# EAGLE design TMP Tester (EAGLE 6.5.0)
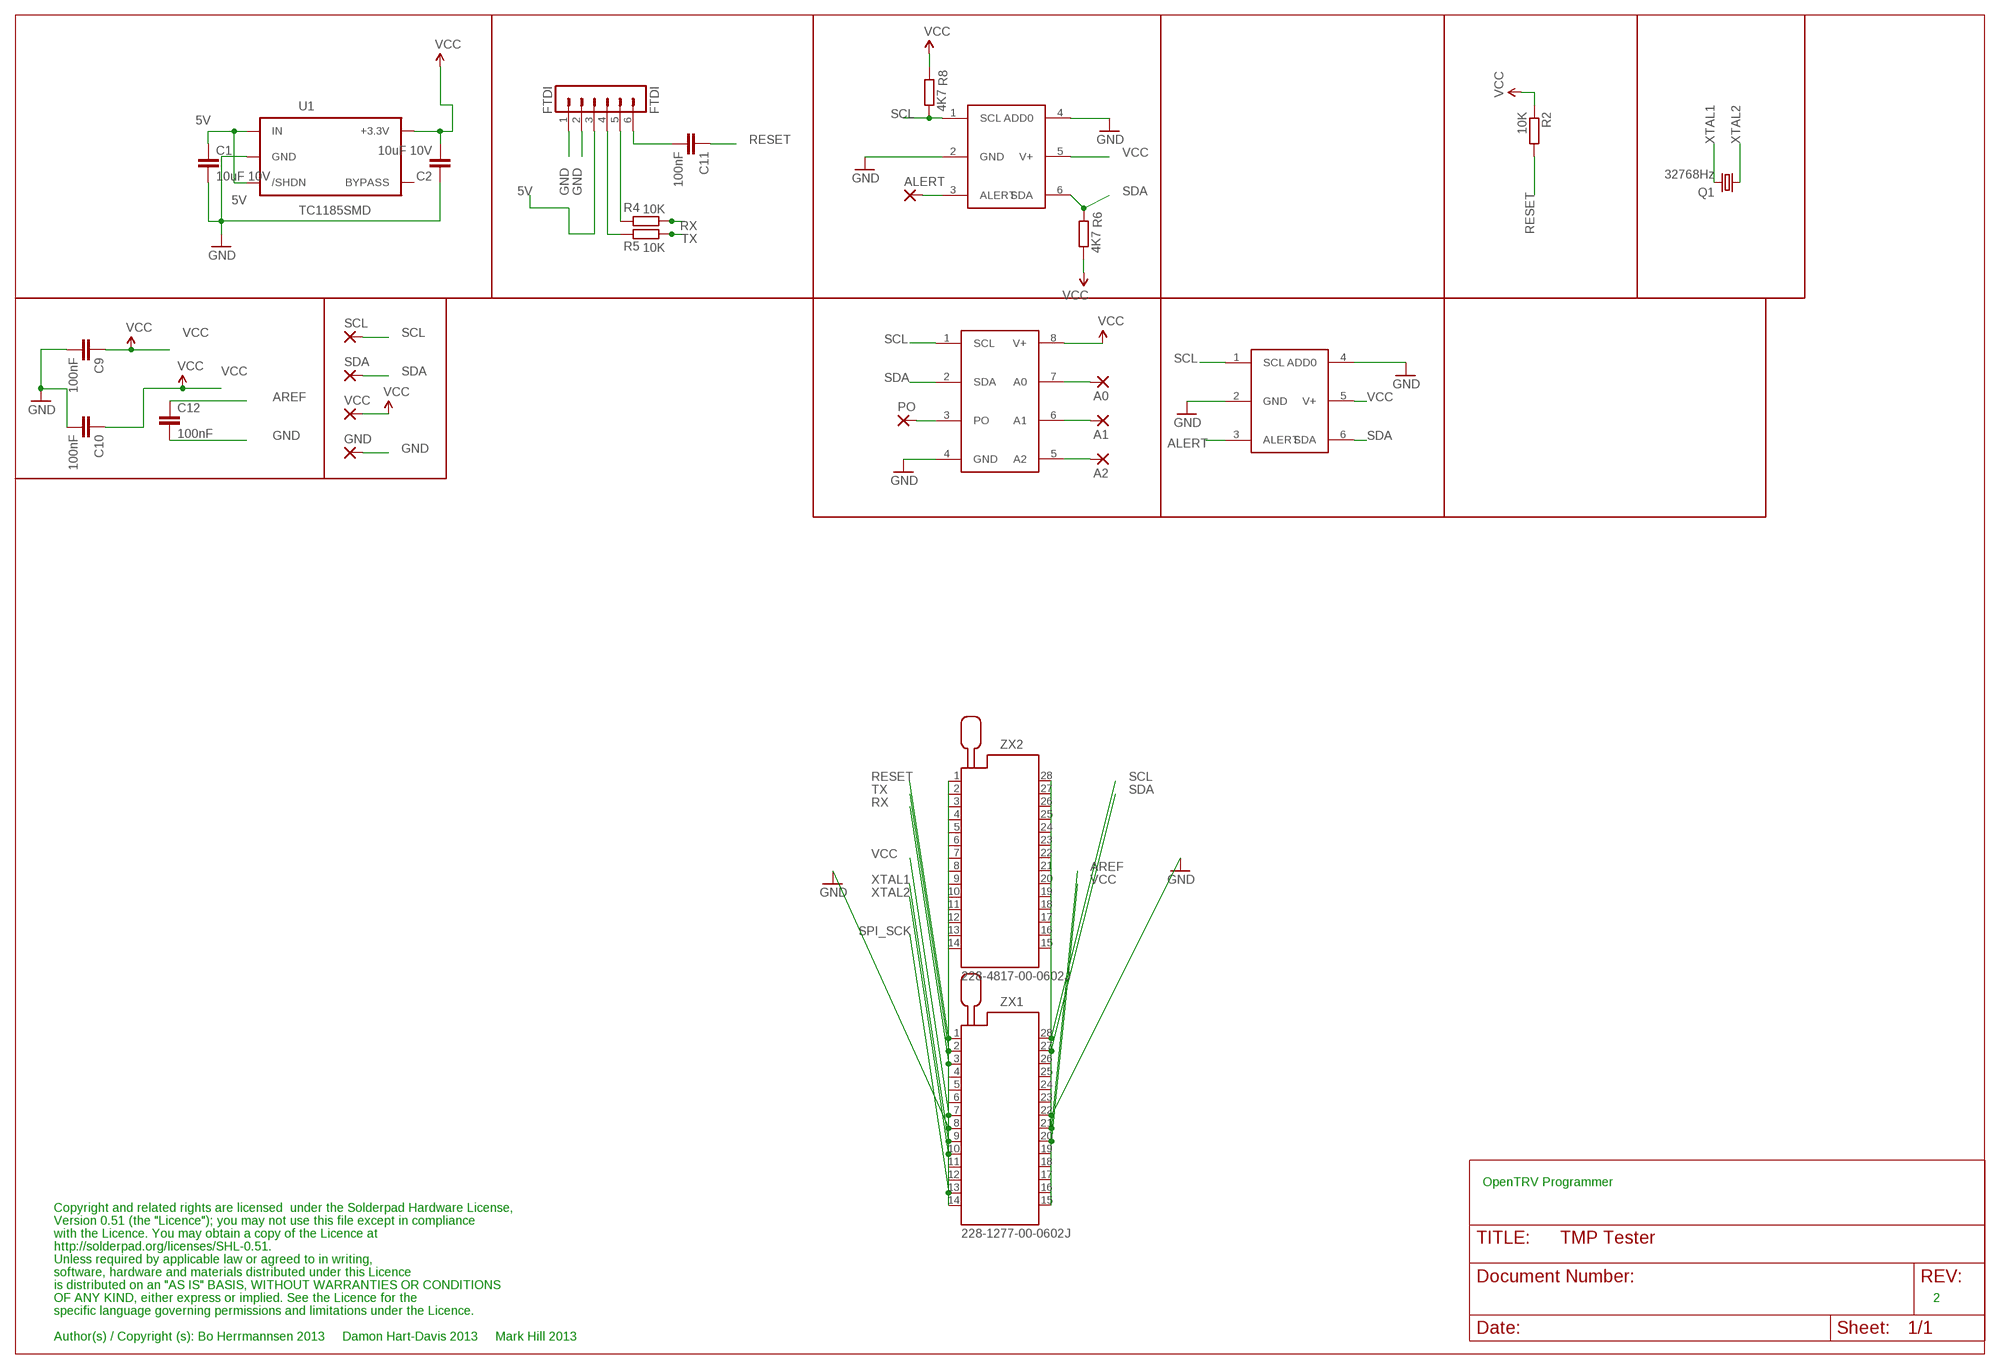
[diagram p0: schematic, sheet 1]

## Parts
A0  2,15/1,0  [2,15/1,0]
A1  2,15/1,0  [2,15/1,0]
A2  2,15/1,0  [2,15/1,0]
ALERT  2,15/1,0  [2,15/1,0]
C1  10uF 10V  CAP0603-CAP  [0603-CAP]
C2  10uF 10V  CAP0603-CAP  [0603-CAP]
C9  100nF  CAP0603-CAP  [0603-CAP]
C10  100nF  CAP0603-CAP  [0603-CAP]
C11  100nF  CAP0603-CAP  [0603-CAP]
C12  100nF  CAP0603-CAP  [0603-CAP]
FTDI  FTDI  MA06-1  [MA06-1]
GND  2,15/1,0  [2,15/1,0]
PO  2,15/1,0  [2,15/1,0]
Q1  32768Hz  MC-306  [MC-306]
R2  10K  R-EU_R0603  [R0603]
R4  10K  R-EU_R0603  [R0603]
R5  10K  R-EU_R0603  [R0603]
R6  4K7  R-EU_R0603  [R0603]
R8  4K7  R-EU_R0603  [R0603]
SCL  2,15/1,0  [2,15/1,0]
SDA  2,15/1,0  [2,15/1,0]
TMP112  TMP112  [TMP112]
U1  TC1185SMD  [TC1185]
U$2  TMP112  [TMP112]
U$3  DS620  [DS620]
VCC  2,15/1,0  [2,15/1,0]
ZX1  228-1277-00-0602J  [228-1277-00-0602J]
ZX2  228-4817-00-0602J  [228-4817-00-0602J]

## Nets
5V: C1.1 FTDI.3(VCC) U1.1(IN) U1.3(/SHDN)
ALERT: ALERT.1(P) TMP112.3(ALERT) U$2.3(ALERT)
AREF: C12.1 ZX1.21 ZX2.21
GND: C1.2 C2.1 C9.2 C10.2 C12.2 FTDI.1(GND) FTDI.2(CTS) GND.1(P) TMP112.2(GND) TMP112.4(ADD0) U1.2(GND) U$2.2(GND) U$2.4(ADD0) U$3.4(GND) ZX1.8 ZX1.22 ZX2.8 ZX2.22
N$1: C11.2 FTDI.6(RTS)
N$3: FTDI.4(TX) R5.2
N$5: FTDI.5(RX) R4.2
N$6: A0.1(P) U$3.7(A0)
N$7: ZX1.4 ZX2.4
N$8: ZX1.5 ZX2.5
N$11: ZX1.6 ZX2.6
N$13: A1.1(P) U$3.6(A1)
N$14: A2.1(P) U$3.5(A2)
N$15: PO.1(P) U$3.3(PO)
N$16: ZX1.11 ZX2.11
N$17: ZX1.12 ZX2.12
N$20: ZX1.14 ZX2.14
N$21: ZX1.15 ZX2.15
N$24: ZX1.16 ZX2.16
N$25: ZX1.17 ZX2.17
N$26: ZX1.18 ZX2.18
N$28: ZX1.19 ZX2.19
N$30: ZX1.23 ZX2.23
N$31: ZX1.24 ZX2.24
N$32: ZX1.25 ZX2.25
N$33: ZX1.26 ZX2.26
RESET: C11.1 R2.2 ZX1.1 ZX2.1
RX: R4.1 ZX1.3 ZX2.3
SCL: R8.1 SCL.1(P) TMP112.1(SCL) U$2.1(SCL) U$3.1(SCL) ZX1.28 ZX2.28
SDA: R6.2 SDA.1(P) TMP112.6(SDA) U$2.6(SDA) U$3.2(SDA) ZX1.27 ZX2.27
SPI_SCK: ZX1.13 ZX2.13
TX: R5.1 ZX1.2 ZX2.2
VCC: C2.2 C9.1 C10.1 R2.1 R6.1 R8.2 TMP112.5(V+) U1.5(+3.3V) U$2.5(V+) U$3.8(V+) VCC.1(P) ZX1.7 ZX1.20 ZX2.7 ZX2.20
XTAL1: Q1.4 ZX1.9 ZX2.9
XTAL2: Q1.1 ZX1.10 ZX2.10
Unconnected: U1.4(BYPASS)

## Notes on the sheet
- OpenTRV Programmer
- Copyright and related rights are licensed  under the Solderpad Hardware License,
- Version 0.51 (the "Licence"); you may not use this file except in compliance
- with the Licence. You may obtain a copy of the Licence at
- http://solderpad.org/licenses/SHL-0.51.
- Unless required by applicable law or agreed to in writing,
- software, hardware and materials distributed under this Licence
- is distributed on an "AS IS" BASIS, WITHOUT WARRANTIES OR CONDITIONS
- OF ANY KIND, either express or implied. See the Licence for the | 2
- specific language governing permissions and limitations under the Licence.
- Author(s) / Copyright (s): Bo Herrmannsen 2013     Damon Hart-Davis 2013     Mark Hill 2013

## Library data of the parts
A0 A1 A2 ALERT GND PO SCL SDA VCC = wirepad:2,15/1,0: THROUGH-HOLE PAD
C1 C2 C9-C12 = SparkFun-Passives:CAP: Capacitor Standard 0603 ceramic capacitor, and 0.1" leaded capacitor.
FTDI = FTDI:MA06-1: PIN HEADER; OC_FARNELL: unknown; OC_NEWARK: unknown
Q1 = crystal:MC-306: kHz RANGE CRYSTAL UNIT SMD Source: MC-306_405_406_E07X.PDF Homepage <http://www.epsontoyocom.co.jp>; MPN: MC-306 60.0KHZ 100PPM ,12.5PF; OC_FARNELL: 1278040; OC_NEWARK: 31M5576
R2 R4-R6 R8 = resistor:R-EU_: RESISTOR, European symbol
TMP112 = TMP112:TMP112
U1 = 3.3VREG:TC1185
U$2 = TMP112_2:TMP112
U$3 = ds620:DS620
ZX1 = con-3m_holes_only:228-?00-0602J: Zero Insertion Force Socked Source: http://www.3M.com/ehpd; MF: 3M; MPN: 228-1277-00-0602J; OC_FARNELL: 9897356; OC_NEWARK: 85K7825
ZX2 = con-3m_holes_only:228-?00-0602J: Zero Insertion Force Socked Source: http://www.3M.com/ehpd; MF: 3M; MPN: 228-4817-00-0602J; OC_FARNELL: 1252775; OC_NEWARK: 85K7834

## Net classes
0 default: width 0.152 mm

## Board
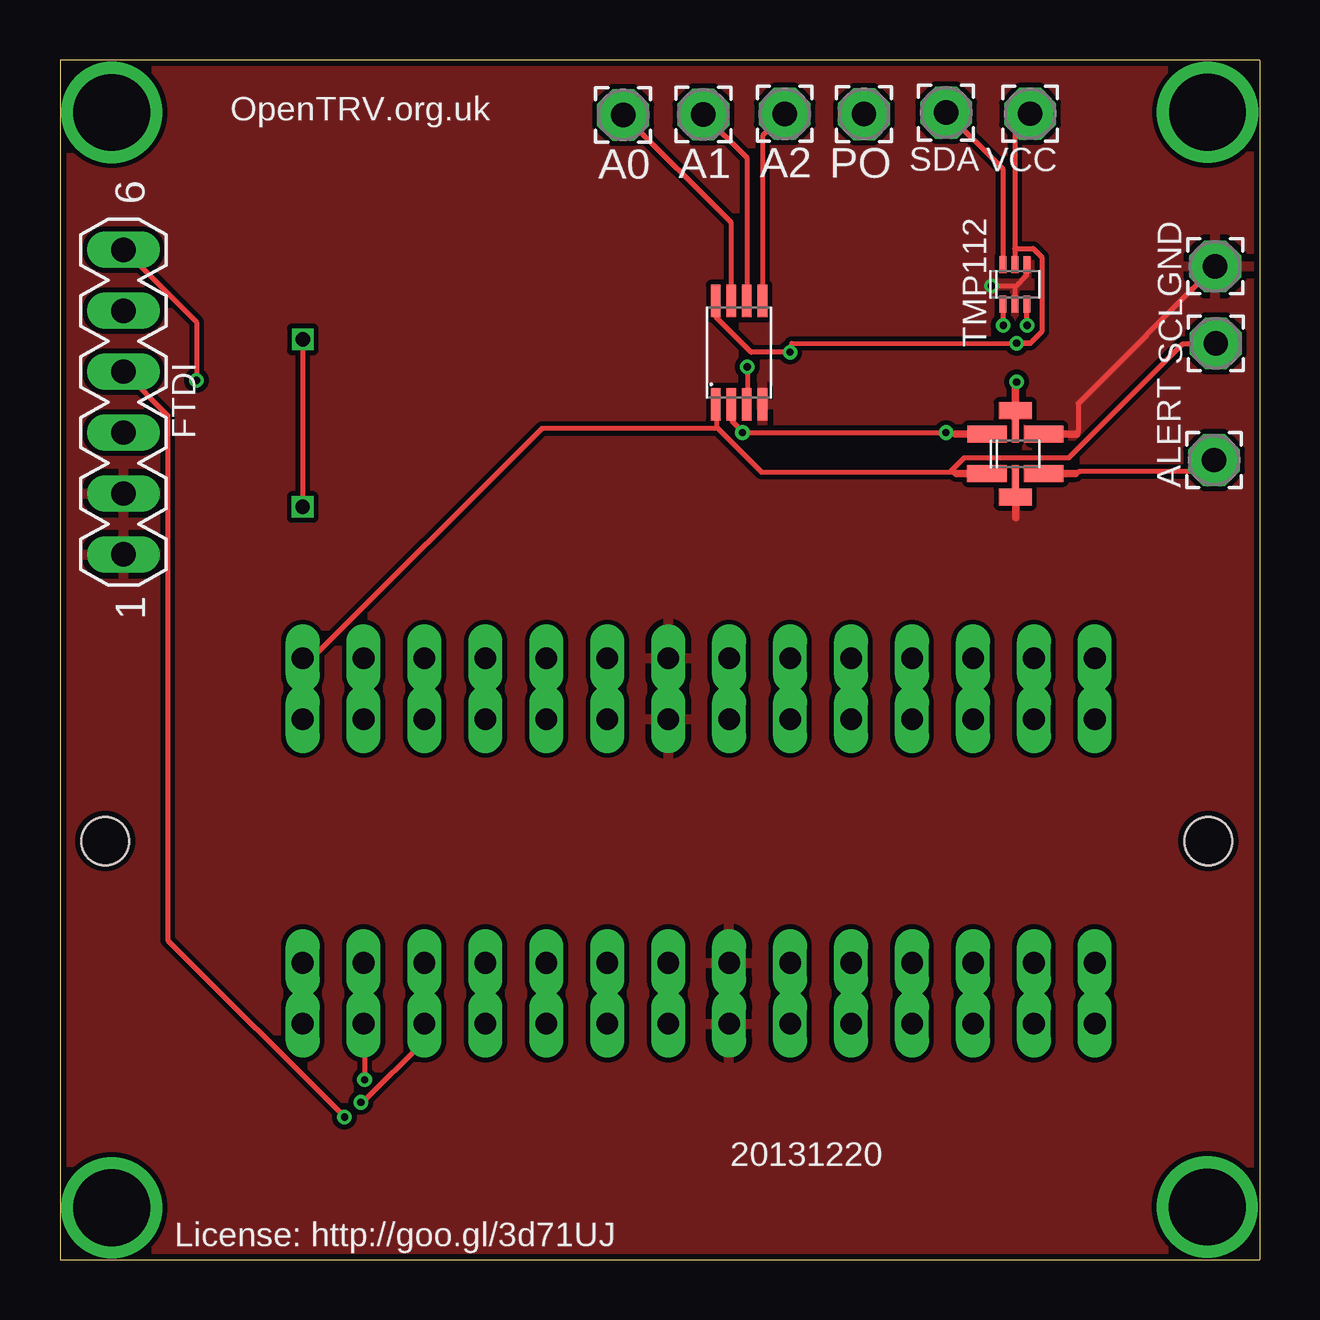
[diagram p1: board, top side]
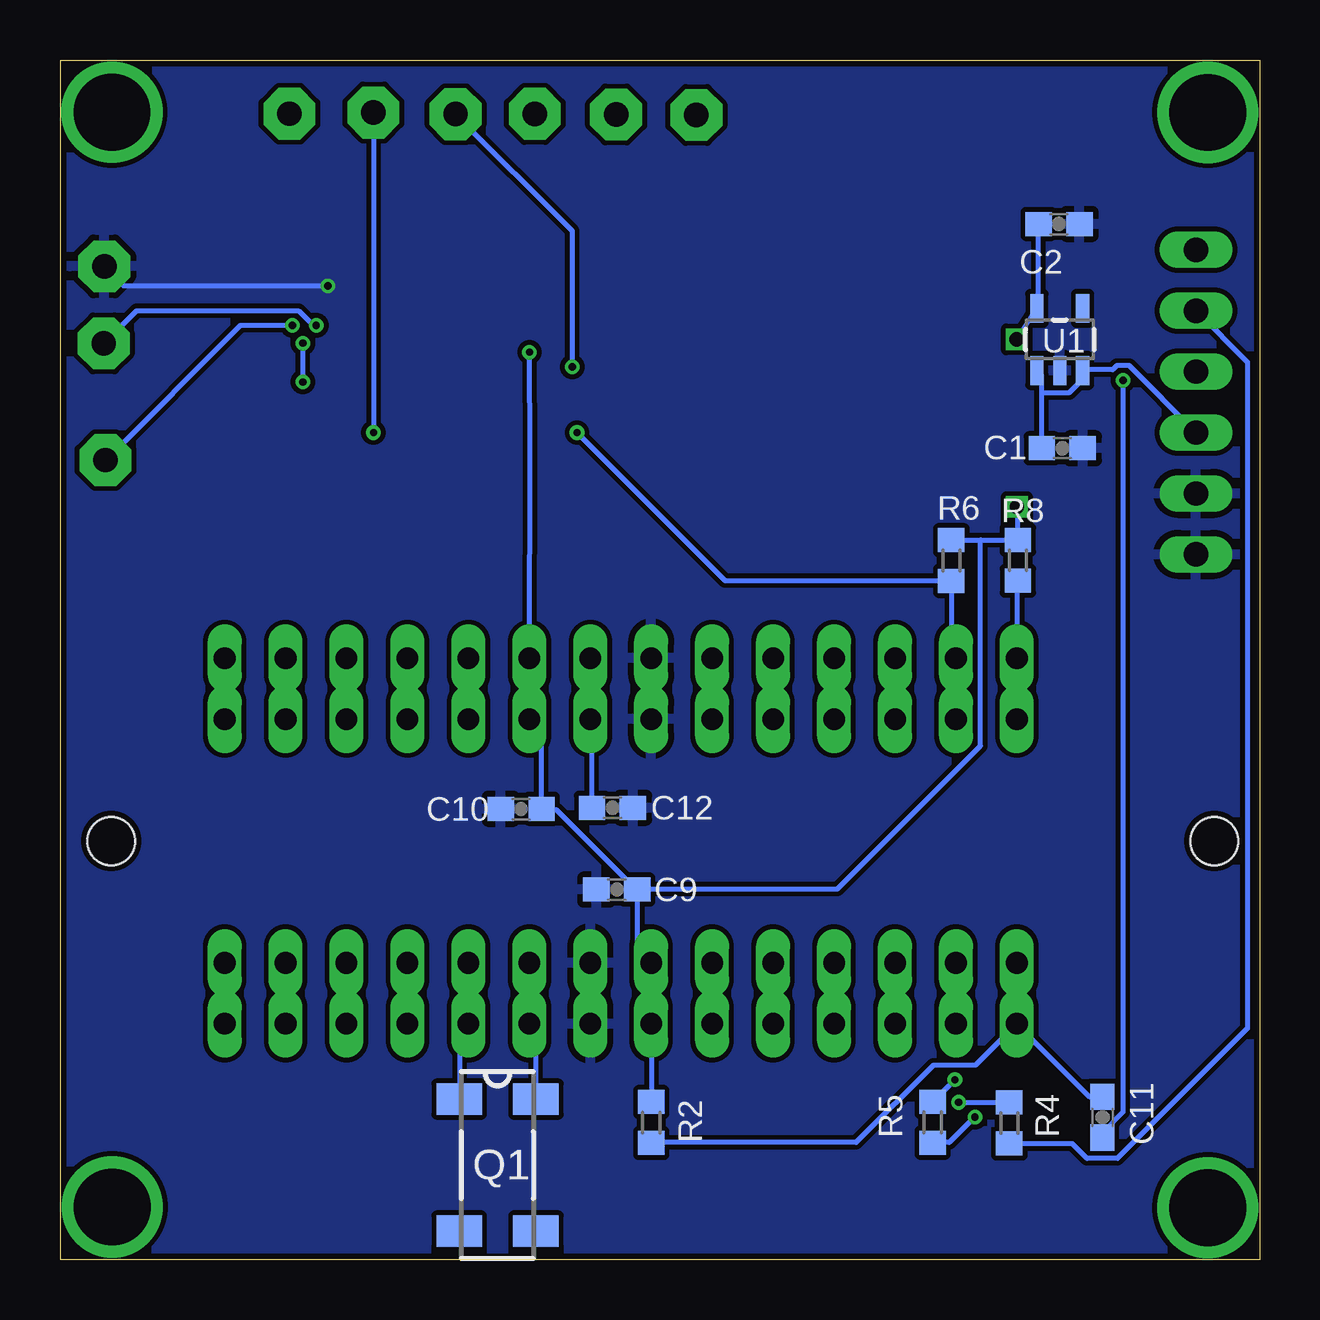
[diagram p2: board, bottom side, seen from below]

Size 50 x 50 mm. Coordinates in mm from the lower left corner, seen from the top.
Outline: 0,0 50,0 50,50 0,50 0,0
Copper layers (1*16): Top 0.035mm / dielectric 1.5mm / Bottom 0.035mm
Design rules "PMServicesStd": minimum track width 8mil, minimum drill 12mil, track to track 8mil, track to pad 8mil, pad to pad 8mil, via to via 8mil, smd to smd 0mil, copper to edge 10mil, drill to drill 10mil, minimum pad ring 10mil, minimum via ring 6mil, stop-mask expansion 2mil, vias tented up to drill 100mil, thermal gap 10mil

### Footprints (pad centres in the part's own frame; a part is rotated, then mirrored left to right if it is on the bottom)
2,15/1,0 = drill 1.016 pad 2.159 octagon: 1 0,0
0603-CAP = smd 1.1 x 1: 1 -0.85,0; 2 0.85,0
MA06-1 = drill 1.016 long: 1 -6.35,0; 2 -3.81,0; 3 -1.27,0; 4 1.27,0; 5 3.81,0; 6 6.35,0
MC-306 = smd 1.3 x 1.9: 1 -2.75,-1.6; 2 2.75,-1.6; 3 2.75,1.6; 4 -2.75,1.6
R0603 = smd 1 x 1.1: 1 -0.85,0; 2 0.85,0
TMP112 = smd 0.285 x 0.7: 1 -0.5,-0.825; 2 0,-0.825; 3 0.5,-0.825; 4 0.5,0.825; 5 0,0.825; 6 -0.5,0.825
TC1185 = smd 0.55 x 1.2: 1 -0.95,-1.3; 2 0,-1.3; 3 0.95,-1.3; 4 0.95,1.3; 5 -0.95,1.3
TMP112' = smd 0.285 x 0.7: 1 -0.5,-0.825; 2 0,-0.825; 3 0.5,-0.825; 4 0.5,0.825; 5 0,0.825; 6 -0.5,0.825; 7 0.777,-0.825; 8 1.325,-0.825; 9 1.05,-0.825; 10 1.868,-0.826; 11 1.595,-0.826; 12 -1.863,-0.825; 13 -1.314,-0.825; 14 -1.59,-0.825; 15 -0.772,-0.825; 16 -1.044,-0.825; 17 -1.86,0.822; 18 -1.312,0.822; 19 -1.587,0.822; 20 -0.769,0.821; 21 -1.041,0.821; 22 0.766,0.824; 23 1.315,0.824; 24 1.039,0.824; 25 1.857,0.823; 26 1.585,0.823; 27 -0.548,1.797; 28 0,1.797; 29 -0.275,1.797; 30 0.543,1.797; 31 0.271,1.797; 32 0.001,1.383; 33 -0.548,-1.798; 34 0,-1.798; 35 -0.275,-1.798; 36 0.543,-1.799; 37 0.271,-1.799; 38 0,-1.322
DS620 = smd 0.4 x 1.35: 1 -0.65,-2.15; 2 0,-2.15; 3 0.65,-2.15; 4 1.3,-2.15; 5 1.3,2.15; 6 0.65,2.15; 7 0,2.15; 8 -0.65,2.15
228-1277-00-0602J = drill 0.9 long: 1 -16.51,-7.62; 2 -13.97,-7.62; 3 -11.43,-7.62; 4 -8.89,-7.62; 5 -6.35,-7.62; 6 -3.81,-7.62; 7 -1.27,-7.62; 8 1.27,-7.62; 9 3.81,-7.62; 10 6.35,-7.62; 11 8.89,-7.62; 12 11.43,-7.62; 13 13.97,-7.62; 14 16.51,-7.62; 15 16.51,7.62; 16 13.97,7.62; 17 11.43,7.62; 18 8.89,7.62; 19 6.35,7.62; 20 3.81,7.62; 21 1.27,7.62; 22 -1.27,7.62; 23 -3.81,7.62; 24 -6.35,7.62; 25 -8.89,7.62; 26 -11.43,7.62; 27 -13.97,7.62; 28 -16.51,7.62 | hole 2: 21.24,0; -24.74,0
228-4817-00-0602J = drill 0.9 long: 1 -16.51,-5.08; 2 -13.97,-5.08; 3 -11.43,-5.08; 4 -8.89,-5.08; 5 -6.35,-5.08; 6 -3.81,-5.08; 7 -1.27,-5.08; 8 1.27,-5.08; 9 3.81,-5.08; 10 6.35,-5.08; 11 8.89,-5.08; 12 11.43,-5.08; 13 13.97,-5.08; 14 16.51,-5.08; 15 16.51,5.08; 16 13.97,5.08; 17 11.43,5.08; 18 8.89,5.08; 19 6.35,5.08; 20 3.81,5.08; 21 1.27,5.08; 22 -1.27,5.08; 23 -3.81,5.08; 24 -6.35,5.08; 25 -8.89,5.08; 26 -11.43,5.08; 27 -13.97,5.08; 28 -16.51,5.08 | hole 2: 21.24,0; -24.74,0

### Placement (x,y rotation side)
A0  23.47,47.71 180 top
A1  26.82,47.73 180 top
A2  30.21,47.76 180 top
ALERT  48.1,33.32 90 top
C1  8.22,33.82 0 bottom
C2  8.36,43.16 180 bottom
C9  26.79,15.43 180 bottom
C10  30.78,18.78 180 bottom
C11  6.55,5.93 270 bottom
C12  26.97,18.83 0 bottom
FTDI  2.65,35.74 90 top
GND  48.15,41.4 180 top
PO  33.51,47.74 180 top
Q1  31.76,3.93 270 bottom
R2  25.35,5.71 270 bottom
R4  10.43,5.69 270 bottom
R5  13.62,5.72 270 bottom
R6  12.85,29.13 270 bottom
R8  10.07,29.14 90 bottom
SCL  48.18,38.19 90 top
SDA  36.93,47.81 180 top
TMP112  39.8,40.64 0 top
U1  8.33,38.35 0 bottom
U$2  TMP112  [TMP112']  39.82,33.59 0 top
U$3  27.98,37.8 0 top
VCC  40.43,47.76 180 top
ZX1  26.62,17.45 0 top
ZX2  26.62,17.45 0 top

### Tracks (layer width: path | path; a pad name or v marks a point on that pad's centre or on a via)
5V
  Bottom 0.203: 9.09,36.14 9.09,36.85 9.27,37.03 U1.1 | 9.09,36.14 9.09,33.83 C1.1 | 9.09,36.14 7.92,36.14 7.39,36.68 7.39,37.03 U1.3 7.29,37.08 6.12,37.08 5.94,37.26 5.44,37.26 2.67,34.49 FTDI.3
ALERT  (via drill 0.3)
  Top 0.203: v40.31,38.94 40.31,39.8 TMP112.3 | 42.33,32.77 42.47,32.84 47.62,32.84 48.08,33.3 ALERT.1
  Top 0.305: U$2.3 41.6,32.77 42.33,32.77
  Bottom 0.203: v40.31,38.94 42.47,38.94 48.08,33.33 ALERT.1
AREF
  Bottom 0.203: C12.1 27.84,18.85 27.84,22.45 27.89,22.5 ZX2.21 27.89,22.63 27.89,25.04 ZX1.21
GND  (via drill 0.3)
  Top 0.203: 39.8,40.54 TMP112.2 | 39.8,40.54 40.28,41.02 40.28,41.45 TMP112.4 | 42.38,34.41 42.44,34.54 42.44,35.69 48.13,41.38 GND.1 | v38.84,40.59 39.73,40.59 39.8,40.54 | ZX1.22 25.33,25.04 | 25.35,22.55 ZX2.22
  Top 0.305: U$2.2 39.83,32.76 39.84,30.92 | U$2.4 41.89,34.41 42.38,34.41
  Bottom 0.203: v38.84,40.59 47.35,40.59 48.13,41.38 GND.1
  pour Bottom: 0,0 50,0 50,50 41.17,49.96 38,50 0,50
  pour Top: 0,50 0,0 50,0 50,50 42.6,50.02 39.28,50.03
N$1  (via drill 0.3)
  Top 0.203: v5.69,36.65 5.69,39.06 2.67,42.09 FTDI.6
  Bottom 0.203: v5.69,36.65 5.69,6.15 6.53,5.31 6.53,5.11 C11.2
N$3  (via drill 0.3)
  Top 0.203: v11.86,5.94 4.5,13.31 4.5,35.18 2.67,37.01 FTDI.4
  Bottom 0.203: v11.86,5.94 12.93,4.88 R5.2
N$4  (via drill 3.2)
  other vias: 2.16,47.81
N$5
  Bottom 0.203: R4.2 10.41,4.83 7.8,4.83 7.19,4.22 5.92,4.22 0.51,9.63 0.51,37.41 FTDI.5
N$6
  Top 0.203: U$3.7 27.96,39.95 27.96,43.23 23.5,47.7 A0.1
N$7
  Top 0.203: ZX1.4 17.73,12.34 ZX2.4
N$8
  Top 0.203: ZX1.5 20.27,12.34 ZX2.5
N$11
  Top 0.203: ZX1.6 22.81,12.34 ZX2.6
N$12  (via drill 3.2)
  other vias: 47.83,2.19
N$13
  Top 0.203: U$3.6 28.63,45.92 A1.1
N$14
  Top 0.203: U$3.5 29.29,46.84 A2.1
N$15  (via drill 0.3)
  Top 0.203: v28.65,37.21 28.65,35.66 U$3.3
  Bottom 0.203: v28.65,37.21 28.65,42.88 33.5,47.73 PO.1
N$16
  Top 0.203: ZX1.11 35.51,12.34 ZX2.11
N$17
  Top 0.203: ZX1.12 38.05,12.34 ZX2.12
N$19  (via drill 3.2)
  other vias: 47.83,47.82
N$20
  Top 0.203: ZX1.14 43.13,9.83 43.13,12.34 ZX2.14
N$21
  Top 0.203: ZX2.15 43.13,22.53 43.13,25.04 ZX1.15
N$22  (via drill 3.2)
  other vias: 2.16,2.16
N$24
  Top 0.203: ZX2.16 40.59,25.04 ZX1.16
N$25
  Top 0.203: ZX2.17 38.05,25.04 ZX1.17
N$26
  Top 0.203: ZX2.18 35.51,25.04 ZX1.18
N$28
  Top 0.203: ZX2.19 32.97,25.04 ZX1.19
N$30
  Top 0.203: ZX2.23 22.81,25.04 ZX1.23
N$31
  Top 0.203: ZX2.24 20.27,25.04 ZX1.24
N$32
  Top 0.203: ZX2.25 17.73,25.04 ZX1.25
N$33
  Top 0.203: ZX2.26 15.19,25.04 ZX1.26
RESET
  Bottom 0.203: C11.1 7.09,6.78 10.11,9.8 ZX1.1 | R2.2 25.35,4.88 16.82,4.88 13.59,8.1 11.84,8.1 10.19,9.75 ZX1.1 | ZX2.1 10.11,12.34 10.11,9.93 ZX1.1
RX  (via drill 0.3)
  Top 0.203: v12.55,6.55 12.62,6.55 15.19,9.12 15.19,9.8 ZX1.3 15.19,9.93 15.19,12.34 ZX2.3
  Bottom 0.203: v12.55,6.55 10.44,6.55 R4.1
SCL  (via drill 0.3)
  Top 0.203: v39.32,38.94 39.32,39.8 TMP112.1 | 37.16,32.82 29.23,32.82 27.36,34.7 | 37.16,32.82 37.21,32.82 37.36,32.76 | 27.36,34.7 27.36,35.64 U$3.1 | ZX1.28 10.13,25.07 10.52,25.07 20.09,34.65 27.28,34.65 27.36,34.7 | SCL.1 48.16,38.18 46.81,38.18 42.06,33.43 37.69,33.43 37.16,32.89 37.16,32.82
  Top 0.305: U$2.1 38.44,32.76 37.36,32.76
  Bottom 0.203: v39.32,38.94 39.45,38.94 40.06,39.55 46.81,39.55 48.16,38.2 SCL.1 | R8.1 10.08,28.27 10.08,25.09 ZX1.28 10.11,24.97 ZX2.28
SDA  (via drill 0.3)
  Top 0.203: 28.5,34.47 v36.93,34.47 37.19,34.47 37.32,34.41 | 28.5,34.47 27.99,34.98 27.99,35.64 U$3.2 | TMP112.6 39.29,45.47 36.96,47.8 SDA.1 | v28.45,34.47 28.5,34.47
  Top 0.305: U$2.6 37.85,34.41 37.32,34.41
  Bottom 0.203: ZX2.27 12.65,24.97 ZX1.27 12.68,25.07 12.83,25.22 12.83,28.27 R6.2 12.95,28.3 22.28,28.3 v28.45,34.47 | v36.93,34.47 SDA.1
SPI_SCK
  Top 0.203: ZX1.13 40.59,12.34 ZX2.13
TX  (via drill 0.3)
  Top 0.203: v12.7,7.49 12.7,9.78 12.68,9.8 ZX1.2 12.65,9.91 12.65,12.34 ZX2.2
  Bottom 0.203: v12.7,7.49 R5.1
VCC  (via drill 0.3, 0.6)
  Top 0.203: 39.8,42.14 39.8,47.14 40.41,47.75 VCC.1 | 39.8,42.14 TMP112.5 | 40.46,38.2 40.92,38.68 40.92,41.78 40.56,42.14 39.8,42.14 | 40.46,38.2 v39.88,38.2 | v39.88,36.58 39.83,36.43 | U$3.8 27.36,39.93 27.36,39.27 28.8,37.82 v30.43,37.82 30.5,38.18 40.46,38.2 | v10.12,38.35 v10.12,31.37
  Top 0.305: U$2.5 39.83,36.43
  Bottom 0.203: v39.88,38.2 v39.88,36.58 | 11.63,30 12.83,30 R6.1 | 11.63,30 10.08,30 R8.2 v10.12,31.37 | C2.2 9.22,39.73 9.27,39.67 U1.5 9.35,39.57 v10.12,38.35 | C9.1 25.93,15.42 25.93,12.93 25.38,12.37 ZX2.7 25.35,12.27 25.35,9.93 ZX1.7 25.35,9.8 25.35,6.58 R2.1 | C9.1 26.04,15.47 29.31,18.75 29.84,18.75 C10.1 29.95,18.8 29.95,22.02 30.43,22.5 ZX2.20 30.43,22.63 30.43,25.04 ZX1.20 30.43,25.17 30.41,33.59 v30.43,37.82 | 11.63,30 11.63,21.41 17.6,15.44 25.83,15.44 C9.1
XTAL1
  Bottom 0.203: Q1.4 30.18,6.71 30.18,9.55 30.43,9.8 ZX1.9 30.43,9.93 30.43,12.34 ZX2.9
XTAL2
  Bottom 0.203: Q1.1 33.35,6.71 33.35,9.45 32.99,9.8 ZX1.10 32.97,9.91 32.97,12.34 ZX2.10

### Text on the board
tPlace: License: http://goo.gl/3d71UJ
tNames: OpenTRV.org.uk | 20131220